# EAGLE design dw-probe-v1.1 (EAGLE 9.5.1)
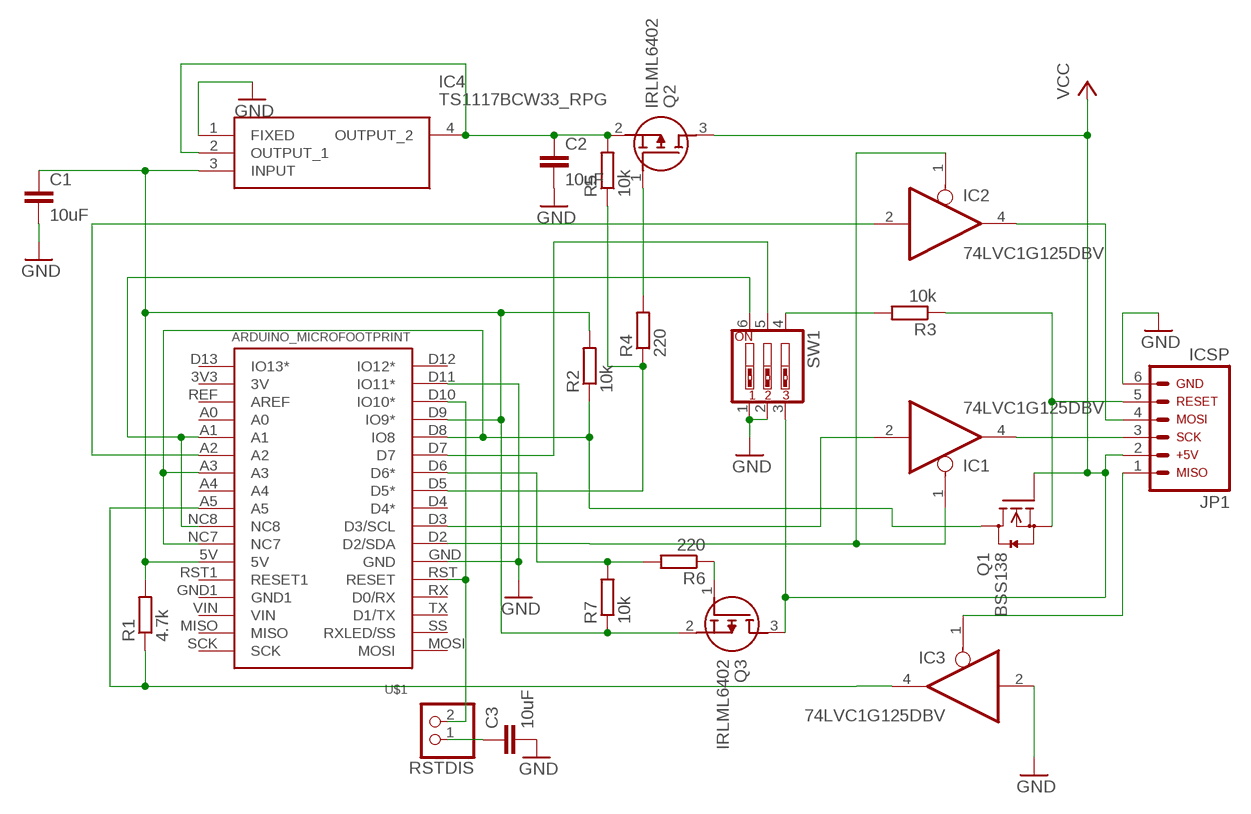
[diagram p0: schematic, sheet 1]

## Parts
C1  10uF  C-EUC0805  [C0805]
C2  10uF  C-EUC0805  [C0805]
C3  10uF  C-EUC0805  [C0805]
IC1  74LVC1G125DBV  [SOT23-5]
IC2  74LVC1G125DBV  [SOT23-5]
IC3  74LVC1G125DBV  [SOT23-5]
IC4  TS1117BCW33_RPG  [SOT230P700X190-4N]
JP1  ARDUINO_CONN-ICSP  [CONN-2X03]
Q1  BSS138  [SOT23]
Q2  IRLML6402  [SOT95P237X112-3N]
Q3  IRLML6402  [SOT95P237X112-3N]
R1  4.7k  R-EU_R0805  [R0805]
R2  10k  R-EU_R0805  [R0805]
R3  10k  R-EU_R0805  [R0805]
R4  220  R-EU_R0805  [R0805]
R5  10k  R-EU_R0805  [R0805]
R6  220  R-EU_R0805  [R0805]
R7  10k  R-EU_R0805  [R0805]
RSTDIS  PINHD-1X2  [1X02]
SW1  SW_DIP-3  [EDG-03]
U$1  ARDUINO_MICROFOOTPRINT  [ARDUINO-MICRO]

## Nets
GND: C1.2 C2.2 C3.2 IC3.2(I) IC4.1(FIXED) JP1.6 SW1.1 SW1.2 U$1.D11(IO11*) U$1.GND
N$1: R3.2 SW1.4
N$2: SW1.6 U$1.A1 U$1.NC8
N$3: IC1.1(OE) IC2.1(OE) U$1.D2(D2/SDA)
N$5: C1.1 IC4.3(INPUT) Q3.2(S) R1.2 R2.2 R7.1 U$1.5V U$1.D9(IO9*)
N$6: IC1.2(I) U$1.D3(D3/SCL)
N$7: IC2.2(I) U$1.A2
N$8: IC3.4(O) R1.1 U$1.A5
N$9: RSTDIS.2 U$1.D10(IO10*) U$1.RST(RESET)
N$10: IC2.4(O) JP1.4
N$11: SW1.5 U$1.D7
N$12: IC3.1(OE) JP1.1
N$13: C3.1 RSTDIS.1
N$14: JP1.5 Q1.2(S) R3.1
N$15: Q3.1(G) R6.1
N$16: C2.1 IC4.2(OUTPUT_1) IC4.4(OUTPUT_2) Q2.2(S) R5.2
N$17: IC1.4(O) JP1.3
N$18: R4.1 R5.1 U$1.D5(D5*)
N$19: Q2.1(G) R4.2
N$20: R6.2 R7.2 U$1.D6(D6*)
N$22: Q1.3(D) R2.1 U$1.A3 U$1.D8(IO8) U$1.NC7
VCC: JP1.2 Q1.1(G) Q2.3(D) Q3.3(D) SW1.3
Unconnected: U$1.3V3(3V) U$1.A0 U$1.A4 U$1.D4(D4*) U$1.D12(IO12*) U$1.D13(IO13*) U$1.GND1 U$1.MISO U$1.MOSI U$1.REF(AREF) U$1.RST1(RESET1) U$1.RX(D0/RX) U$1.SCK U$1.SS(RXLED/SS) U$1.TX(D1/TX) U$1.VIN

## Power pins joined to a net without a drawn wire
GND: IC1.3(GND) IC2.3(GND) IC3.3(GND)
VCC: IC1.5(VCC) IC2.5(VCC) IC3.5(VCC)

## Library data of the parts
C1-C3 = rcl:C-EU: CAPACITOR, European symbol; SPICEPREFIX: C
IC1-IC3 = 74xx-little-us:74*1G125: Single Bus Buffer Gate with 3-State Output
IC4 = TS1117BCW33_RPG:TS1117BCW33_RPG: Taiwan Semiconductor TS1117BCW33 RPG, LDO Regulator, 800mA, 3.3 V, +/-2% 4-Pin, SOT-223 Source: Datasheet <http://uk.rs-online.com/web/p/products/1698939>; ARROW_PART_NUMBER: TS1117BCW33 RPG; ARROW_PRICE-STOCK: https://www.arrow.com/en/products/ts1117bcw33rpg/taiwan-semiconductor; DESCRIPTION: Taiwan Semiconductor TS1117BCW33 RPG, LDO Regulator, 800mA, 3.3 V, +/-2% 4-Pin, SOT-223; HEIGHT: 1.9mm; MANUFACTURER_NAME: Taiwan Semiconductor; MANUFACTURER_PART_NUMBER: TS1117BCW33 RPG; MOUSER_PART_NUMBER: 821-TS1117BCW33RPG; MOUSER_PRICE-STOCK: https://www.mouser.co.uk/ProductDetail/Taiwan-Semiconductor/TS1117BCW33-RPG?qs=5aG0NVq1C4zdwcJSPRwZGg%3D%3D
JP1 = arduino_jw:ARDUINO_CONN-ICSP: Arduino ICSP I/O Header This is the ICSP I/O header on the Arduino Uno R3. This connector is labeled with the following pin assignments: MISO +5V SCK MOSI RESET GND NOTE: Be sure you install this connector with the correct orientation on your PCB layout. Pin 1 has a square pad to assist with orientation.
Q1 = m-pad-2.1:BSS138: Fairchild Semiconductors BSS138 N-Channel Logic Level Enhancement Mode Field Effect Transistor General Description: These N-Channel enhancement mode field effect transistors are produced using Fairchild's proprietary, high cell density, DMOS technology. These products have been designed to minimize on-state resistance while provide rugged, reliable, and fast switching performance.These products are particularly suited for low voltage, low current applications such as small servo motor control, power MOSFET gate drivers, and other switching applications. Features: 0.22 A, 50 V. RDS(ON) = 3.5Ohm @ VGS = 10 V RDS(ON) = 6.0Ohm @ VGS = 4.5 V High density cell design for extremely low RDS(ON) Rugged and Reliable Compact industry standard SOT-23 surface mount package Please send any comments to: messi@users.sourceforge.net
Q2 Q3 = IRLML6402:IRLML6402: P-Channel MOSFET Transistor, 3.7 A, 20 V, 3-Pin SOT-23 International Rectifier IRLML6402 Source: Datasheet <https://datasheetspdf.com/pdf/513015/InternationalRectifier/IRLML6402/1>; DESCRIPTION: P-Channel MOSFET Transistor, 3.7 A, 20 V, 3-Pin SOT-23 International Rectifier IRLML6402; HEIGHT: 1.12mm; MANUFACTURER_NAME: Infineon; MANUFACTURER_PART_NUMBER: IRLML6402; MOUSER_PART_NUMBER: N/A; MOUSER_PRICE-STOCK: https://www.mouser.co.uk/ProductDetail/Infineon-IR/IRLML6402/?qs=Gkr2N%2F2q3o277qI%252BRzUP%252Bw%3D%3D
R1-R7 = rcl:R-EU_: RESISTOR, European symbol; SPICEPREFIX: R
RSTDIS = pinhead:PINHD-1X2: PIN HEADER
SW1 = special:SW_DIP-3: DIP SWITCH
U$1 = arduino-micro:ARDUINO_MICRO

## Board
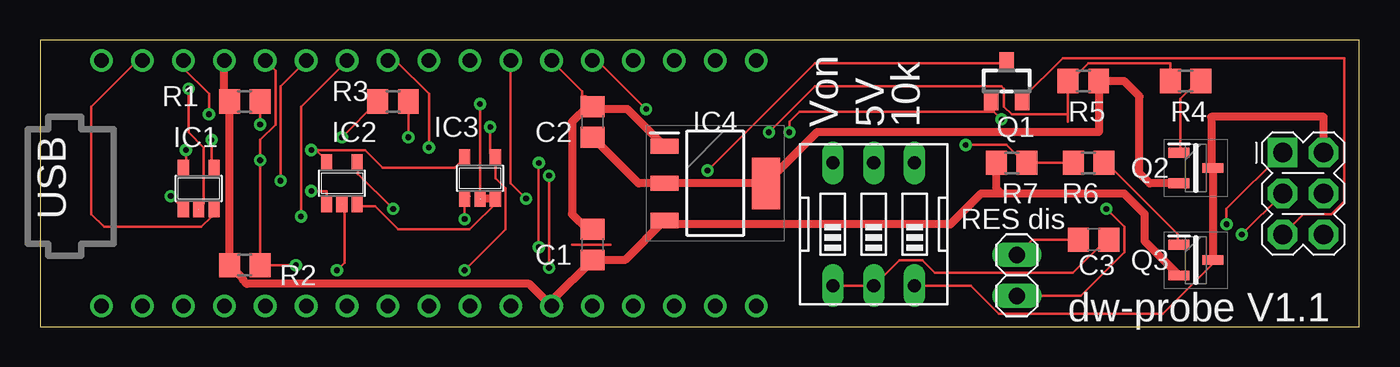
[diagram p1: board, top side]
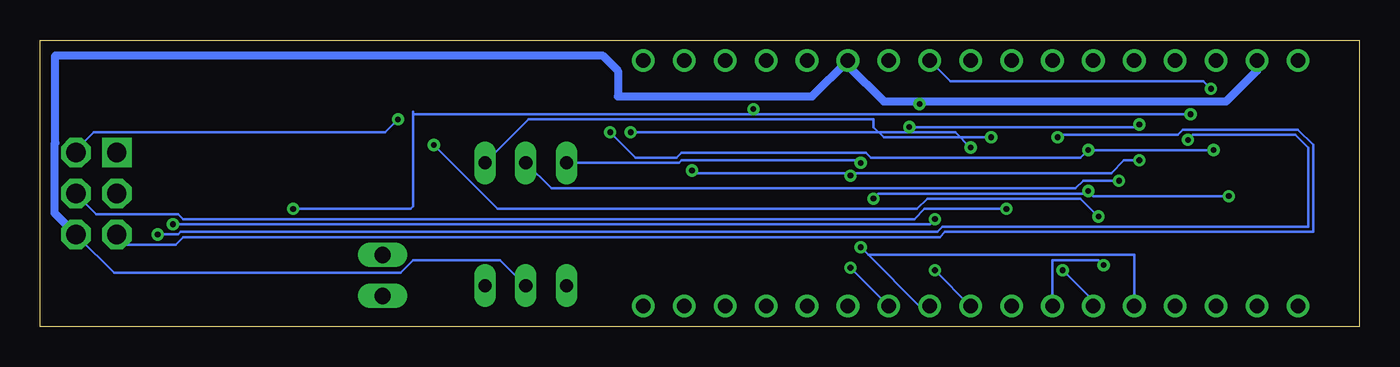
[diagram p2: board, bottom side, seen from below]

Size 81.9 x 17.77 mm. Coordinates in mm from the lower left corner, seen from the top.
Outline: 0,0 81.9,0 81.9,17.77 0,17.77 0,0
Copper layers (1*16): Top 0.035mm / dielectric 1.5mm / Bottom 0.035mm
Design rules "default *": minimum track width 6mil, minimum drill 0.35mm, track to track 6mil, track to pad 6mil, pad to pad 6mil, via to via 6mil, smd to smd 6mil, copper to edge 10mil, drill to drill 6mil, minimum pad ring 10mil, minimum via ring 8mil, stop-mask expansion 4mil, vias tented up to drill 0mil, thermal gap 10mil

### Footprints (pad centres in the part's own frame; a part is rotated, then mirrored left to right if it is on the bottom)
C0805 = smd 1.3 x 1.5: 1 -0.95,0; 2 0.95,0
SOT23-5 = smd 0.69 x 0.99: 1 -0.95,-1.29; 2 0,-1.29; 3 0.95,-1.29; 4 0.95,1.3; 5 -0.95,1.3
SOT230P700X190-4N = smd 1.75 x 0.95: 1 -3.15,2.3; 2 -3.15,0; 3 -3.15,-2.3 | smd 1.75 x 3.2: 4 3.15,0
CONN-2X03 = drill 1.2 pad 1.829 square: 1 0,0 | drill 1.2 pad 1.829 octagon: 2 2.54,0; 3 0,-2.54; 4 2.54,-2.54; 5 0,-5.08; 6 2.54,-5.08
SOT23 = smd 0.9 x 1.2: 1 -0.95,-1.2; 2 0.95,-1.2; 3 0,1.2
SOT95P237X112-3N = smd 1.3 x 0.6: 1 -1.05,0.95; 2 -1.05,-0.95; 3 1.05,0
R0805 = smd 1.3 x 1.5: 1 -0.95,0; 2 0.95,0
1X02 = drill 1.016 long: 1 -1.27,0; 2 1.27,0
EDG-03 = drill 0.813 long: 1 -2.54,-3.81; 2 0,-3.81; 3 2.54,-3.81; 4 2.54,3.81; 5 0,3.81; 6 -2.54,3.81
ARDUINO-MICRO = drill 0.9: 3V3 16.51,3.81; 5V 16.51,29.21; A0 16.51,8.89; A1 16.51,11.43; A2 16.51,13.97; A3 16.51,16.51; A4 16.51,19.05; A5 16.51,21.59; D2 1.27,26.67; D3 1.27,24.13; D4 1.27,21.59; D5 1.27,19.05; D6 1.27,16.51; D7 1.27,13.97; D8 1.27,11.43; D9 1.27,8.89; D10 1.27,6.35; D11 1.27,3.81; D12 1.27,1.27; D13 16.51,1.27; GND 1.27,29.21; GND1 16.51,34.29; MISO 16.51,39.37; MOSI 1.27,41.91; NC7 16.51,26.67; NC8 16.51,24.13; REF 16.51,6.35; RST 1.27,31.75; RST1 16.51,31.75; RX 1.27,34.29; SCK 16.51,41.91; SS 1.27,39.37; TX 1.27,36.83; VIN 16.51,36.83

### Placement (x,y rotation side)
C1  34.29,5.08 90 top
C2  34.29,12.7 90 top
C3  65.41,5.4 0 top
IC1  9.84,8.57 0 top
IC2  18.73,8.89 0 top
IC3  27.3,9.21 0 top
IC4  41.91,8.89 0 top
JP1  77.15,10.79 0 top
Q1  60.01,15.24 0 top
Q2  71.75,9.84 0 top
Q3  71.75,4.13 0 top
R1  12.7,13.97 180 top
R2  12.7,3.81 180 top
R3  21.91,13.97 0 top
R4  71.12,15.24 0 top
R5  64.77,15.24 0 top
R6  65.09,10.16 180 top
R7  60.33,10.16 0 top
RSTDIS  60.64,3.17 270 top
SW1  51.75,6.35 0 top
U$1  2.54,17.78 270 top

### Tracks (layer width: path | path; a pad name or v marks a point on that pad's centre or on a via)
GND  (via drill 0.35)
  Top 0.152: C3.2 | 34.45,13.34 34.45,13.49 C2.2 33.66,14.29 33.66,14.61 U$1.GND | 38.73,11.27 IC4.1 | 66.2,5.4 C3.2 | 66.2,5.4 64.14,3.33 55.56,3.33 54.77,4.13 53.34,4.13 SW1.2 SW1.1 | 66.2,5.4 C3.2 | IC2.3 19.68,7.46 20.8,7.46 22.23,6.03 26.67,6.03 28.42,7.78 IC3.3 | U$1.D11 6.03,16.51 3.17,13.65 3.17,6.99 3.97,6.19 10,6.19 10.64,6.83 10.64,7.14 IC1.3 | v27.3,13.81 27.3,8.1 IC3.2
  Top 0.508: 33.81,14.13 C2.2 33.97,13.65 33.02,12.7 33.02,6.99 33.98,6.03 C1.2 | IC3.3 IC3.2 | IC4.1 36.46,13.49 34.45,13.49
  Bottom 0.152: v27.3,13.81 27.3,13.97 | SW1.2 53.34,4.13 58.74,4.13 59.53,3.33 77.31,3.33 79.53,5.56 JP1.6
  Bottom 0.508: JP1.6 81.01,7.04 81.01,11.34 80.96,11.39 80.96,16.83 46.99,16.83 46.04,15.88 46.04,14.29 33.97,14.29 U$1.GND 31.75,16.19 29.53,13.97 27.3,13.97 8.26,13.97 6.35,15.88 U$1.D11
N$1  (via drill 0.35)
  Top 0.152: R3.2 | v22.86,11.75 R3.2
  Bottom 0.152: v22.86,11.75 29.53,11.75 30.16,12.38 30.16,12.87 51.58,12.87 SW1.4
N$2  (via drill 0.35)
  Top 0.152: v30.96,4.92 v30.96,10.16
  Bottom 0.152: SW1.6 42.23,10.16 42.07,10.32 31.11,10.32 v30.96,10.16 | 30.48,4.45 27.3,1.27 U$1.NC8 | 30.48,4.45 v30.96,4.92 | U$1.A1 13.97,4.45 30.48,4.45
N$3  (via drill 0.35)
  Top 0.152: v16.83,8.41 17.78,8.41 17.78,7.62 IC2.1 | v8.1,8.1 8.1,8.08 IC1.1 | U$1.D2 29.21,8.89 v30.16,7.94
  Bottom 0.152: v8.1,8.1 16.51,8.1 v16.83,8.41 16.99,8.26 29.84,8.26 v30.16,7.94
N$4
  Top 0.152: 35.4,5.08 33.02,5.08
N$5
  Top 0.508: Q3.2 68.58,5.3 68.58,6.99 67.31,8.26 59.69,8.26 | 59.69,8.26 59.38,8.57 R7.1 | 59.69,8.26 58.42,8.26 56.52,6.35 39,6.35 IC4.3 36.3,4.13 C1.1 31.75,1.59 U$1.5V 30.37,2.65 12.83,2.65 12.59,2.89 12.59,2.97 R2.2 R1.2 11.43,14.29 U$1.D9
N$6  (via drill 0.35)
  Top 0.152: IC1.2 9.84,7.3 10.16,7.62 10.16,7.94 10.16,11.11 9.21,12.06 v9.21,14.76
  Bottom 0.152: v9.21,14.76 9.68,15.24 25.4,15.24 U$1.D3
N$7  (via drill 0.35)
  Top 0.152: 18.89,7.3 18.73,7.46 IC2.2 18.89,7.3 | 18.89,7.3 18.89,3.97 v18.41,3.49
  Bottom 0.152: v18.41,3.49 16.51,1.59 U$1.A2
N$8  (via drill 0.35)
  Top 0.152: IC3.4 27.94,10.82 | v26.35,3.49 28.89,6.03 28.89,8.57 28.26,9.21 28.26,10.48 IC3.4 | v13.65,12.54 R1.1 | v27.94,12.38 27.94,10.79 IC3.4
  Bottom 0.152: U$1.A5 v26.35,3.49 | v13.65,12.54 13.81,12.38 v27.94,12.38
N$9  (via drill 0.35)
  Top 0.152: v66.2,7.3 67.31,6.19 67.31,4.6 64.61,1.91 RSTDIS.2 | U$1.D10 8.89,16.03 10.48,14.45 v10.48,13.18 | U$1.RST 34.61,16.51 v37.62,13.49
  Bottom 0.152: 58.74,13.34 58.74,13.18 | 58.74,13.18 58.74,7.46 58.9,7.3 v66.2,7.3 | 58.74,13.18 37.62,13.18 | 37.62,13.18 v10.48,13.18 | 37.62,13.18 v37.62,13.49
N$10  (via drill 0.35)
  Top 0.152: 19.74,9.47 19.74,9.53 | 19.74,9.53 IC2.4 | v21.91,7.3 19.68,9.53 19.74,9.53
  Bottom 0.152: v21.91,7.3 26.99,7.3 27.62,6.67 73.03,6.67 73.34,6.99 78.42,6.99 JP1.4
N$11  (via drill 0.35)
  Top 0.152: v14.92,9.05 14.92,14.92 U$1.D7
  Bottom 0.152: SW1.5 50.16,8.57 17.62,8.57 17.14,9.05 v14.92,9.05
N$12  (via drill 0.35)
  Top 0.152: 26.67,8.1 26.51,7.94 IC3.1 | IC3.1 | v26.35,6.67 26.35,7.78 IC3.1 | v73.66,6.35 73.66,7.3 JP1.1
  Bottom 0.152: v26.35,6.67 26.67,6.35 v73.66,6.35
N$13
  Top 0.152: C3.1 | C3.1 61.59,5.4 RSTDIS.1
N$14  (via drill 0.35)
  Top 0.152: 60.96,14.13 Q1.2 | 21.11,13.97 R3.1 v18.73,11.75 | 60.8,13.97 Q1.2 | 60.96,14.13 63.5,16.67 80.96,16.67 80.96,7.78 80.17,6.99 78.42,6.99 JP1.5 | 60.96,14.13 Q1.2
  Bottom 0.152: v18.73,11.75 18.57,11.91 11.27,11.91 10.95,12.22 3.81,12.22 2.86,11.27 2.86,5.87 25.72,5.87 26.04,5.56 73.03,5.56 73.5,5.08 76.52,5.08 JP1.5
N$15
  Top 0.152: 66.2,10.16 R6.1 66.2,10.16 | 70.64,5.08 Q3.1 70.64,5.08 | 70.64,5.08 70.64,5.71 66.2,10.16
N$16
  Top 0.508: Q2.2 68.9,8.89 68.26,9.53 68.26,14.29 67.31,15.24 R5.2 65.72,12.06 48.23,12.06 IC4.4 IC4.2 37.15,8.89 C2.1
N$17  (via drill 0.35)
  Top 0.152: 10.79,10 IC1.4 10.64,10 v10.64,11.59 | JP1.3 v74.61,5.71
  Bottom 0.152: v10.64,11.59 10.32,11.91 3.97,11.91 3.17,11.11 3.17,6.19 25.88,6.19 26.19,5.87 73.18,5.87 73.34,5.71 v74.61,5.71
N$18  (via drill 0.35)
  Top 0.152: 63.98,15.24 R5.1 | R4.1 70.17,16.35 65.09,16.35 63.98,15.24 | 63.82,13.18 R5.1 | 63.82,13.18 63.82,12.7 | 63.98,15.24 R5.1 | 63.82,13.18 60.33,13.18 59.85,13.65 59.85,14.76 59.69,14.92 48.1,14.92 v45.24,12.06 | v24.13,11.11 24.13,14.45 22.07,16.51 U$1.D5
  Bottom 0.152: v24.13,11.11 25.08,12.06 v45.24,12.06
N$19
  Top 0.152: 70.8,10.79 Q2.1 70.8,10.79 | 71.91,15.24 R4.2 71.91,15.24 | 70.8,10.79 70.8,14.13 71.91,15.24
N$20  (via drill 0.35)
  Top 0.152: R7.2 | R6.2 | 61.12,10.16 R7.2 | R6.2 R7.2 | R7.2 | 61.12,10.16 60.01,11.27 v57.47,11.27 | v16.19,6.83 16.19,13.65 U$1.D6 | 61.12,10.16 R7.2
  Bottom 0.152: v57.47,11.27 53.5,7.3 27.46,7.3 26.83,7.94 17.3,7.94 v16.19,6.83
N$22  (via drill 0.35)
  Top 0.152: 60.01,16.35 Q1.3 60.01,16.35 | R2.1 v13.65,10.32 13.65,11.59 14.61,12.54 14.61,15.88 U$1.D8 | R2.1 | R2.1 v15.88,3.81 | 60.01,16.35 48.1,16.35 v41.43,9.68 | v31.59,9.37 v31.59,3.65
  Bottom 0.152: U$1.A3 19.05,4.13 16.19,4.13 v15.88,3.81 | v41.43,9.68 41.27,9.53 31.59,9.53 | 31.59,9.53 15.4,9.53 14.61,10.32 v13.65,10.32 | v31.59,3.65 U$1.NC7 | 31.59,9.53 v31.59,9.37
VCC  (via drill 0.35)
  Top 0.152: 9.05,10 IC1.5 9.05,10 | 17.78,10.32 IC2.5 17.78,10.32 | IC3.5 26.35,10.48 25.72,9.84 21.27,9.84 20.16,10.95 17.14,10.95 | 58.98,14.04 Q1.1 59.21,13.97 59.21,13.34 | 72.71,3.97 Q3.3 72.87,3.97 69.69,0.79 59.53,0.79 57.78,2.54 SW1.3 | v9.05,10.95 9.05,10 | 17.14,10.95 v16.83,10.95 17.14,10.95 | 17.78,10.32 17.14,10.95 | v59.69,12.86 59.21,13.34 | v46.51,12.06 46.51,12.7 47.15,13.34 59.21,13.34
  Top 0.508: JP1.2 79.69,13.02 72.71,13.02 72.71,9.94 Q2.3 Q3.3
  Bottom 0.152: 79.69,10.95 JP1.2 79.69,10.95 | v9.05,10.95 v16.83,10.95 17.3,10.48 30.32,10.48 30.64,10.79 42.07,10.79 42.39,10.48 44.93,10.48 v46.51,12.06 | v59.69,12.86 60.48,12.06 78.58,12.06 79.69,10.95

### Text on the board
tNames: Von | 5V | 10k | USB | RES dis | dw-probe V1.1